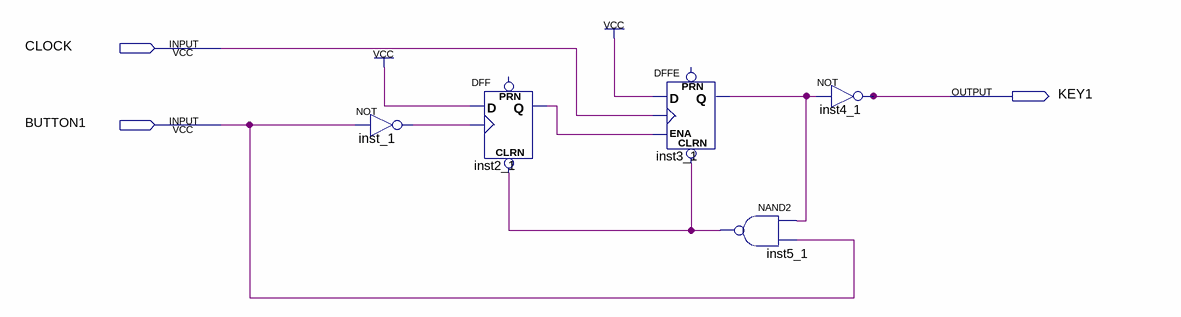
[diagram p0: schematic sheet]
// Quartus schematic Button_Debounce1.bdf as structural Verilog: 5 symbols, 3 pins
module Button_Debounce1 (
  input  CLOCK,
  input  BUTTON1,
  output KEY1
);

  wire inst2_1_q, inst3_1_q, inst5_1_out, inst_1_out;

  not inst_1 (inst_1_out, BUTTON1);
  DFF inst2_1 (.CLRN(inst5_1_out), .CLK(inst_1_out), .D(1'b1), .Q(inst2_1_q));  // open: PRN
  DFFE inst3_1 (.CLRN(inst5_1_out), .D(1'b1), .CLK(CLOCK), .ENA(inst2_1_q), .Q(inst3_1_q));  // open: PRN
  nand inst5_1 (inst5_1_out, inst3_1_q, BUTTON1);
  not inst4_1 (KEY1, inst3_1_q);
endmodule
